# EAGLE design control-board-v2 (EAGLE 6.4)
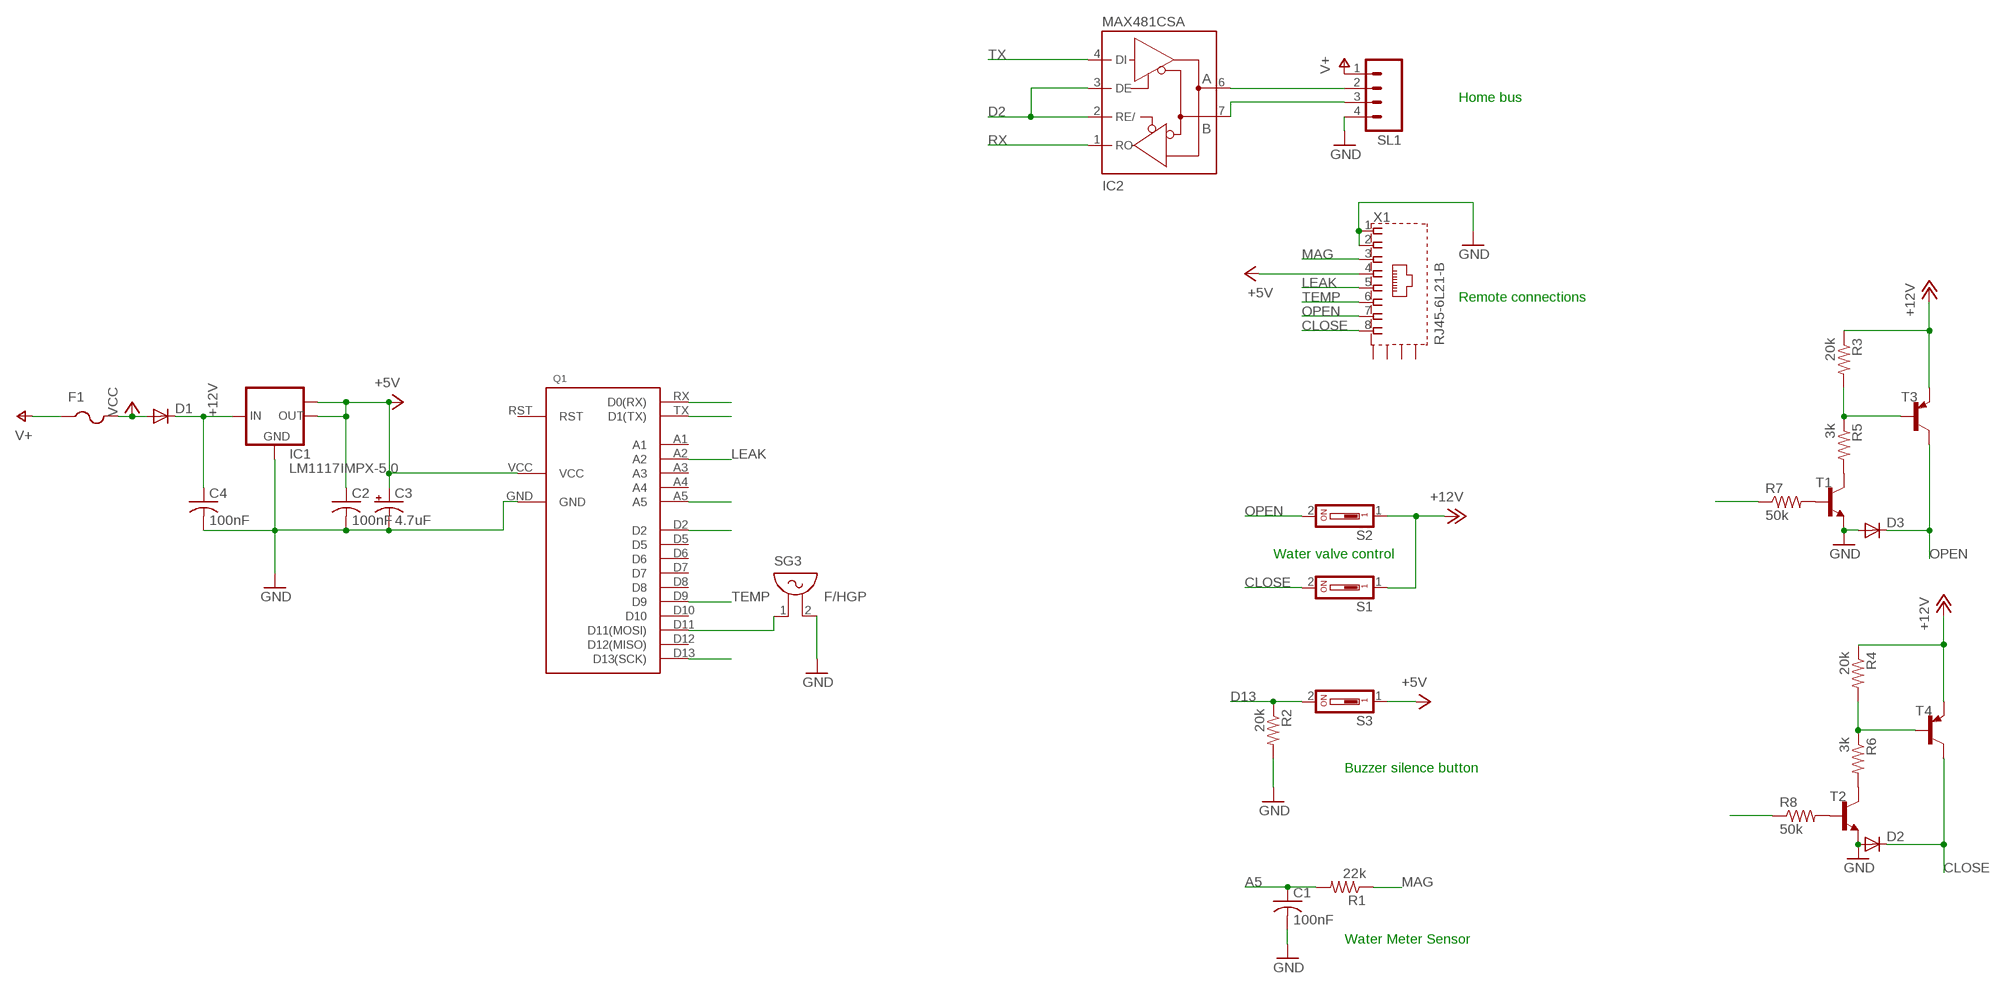
[diagram p0: schematic, sheet 1]

## Parts
C1  100nF  C-USC0603K  [C0603K]
C2  100nF  C-USC0603K  [C0603K]
C3  4.7uF  CPOL-USE1.8-4  [E1,8-4]
C4  100nF  C-USC0603K  [C0603K]
D1  DIODE-MICROMELF-W  [MICROMELF-W]
D2  DIODE-MICROMELF-W  [MICROMELF-W]
D3  DIODE-MICROMELF-W  [MICROMELF-W]
F1  PTCFUSE-1812  [1812]
IC1  LM1117IMPX-5.0  [SOT223]
IC2  MAX481CSA  [SO08]
Q1  HOME-CPU-V1  [HOME-CPU-V1]
R1  22k  R-US_R0603  [R0603]
R2  20k  R-US_R0603  [R0603]
R3  20k  R-US_R0603  [R0603]
R4  20k  R-US_R0603  [R0603]
R5  3k  R-US_R0603  [R0603]
R6  3k  R-US_R0603  [R0603]
R7  50k  R-US_R0603  [R0603]
R8  50k  R-US_R0603  [R0603]
S1  DS01  [DS-01]
S2  DS01  [DS-01]
S3  DS01  [DS-01]
SG3  F/HGP  [F/HGP]
SL1  M04  [04P]
T1  BC808-NPN-SOT23-BEC  [SOT23-BEC]
T2  BC808-NPN-SOT23-BEC  [SOT23-BEC]
T3  BC807-16-PNP-SOT23-BEC  [SOT23-BEC]
T4  BC807-16-PNP-SOT23-BEC  [SOT23-BEC]
X1  RJ45-6L21-B  [RJ45-SHIELD1]

## Nets
+12V: C4.1 D1.C IC1.3(IN) R3.1 R4.1 S1.1 S2.1 T3.E T4.E
A5: C1.1 Q1.A5 R1.2
CLOSE: D2.C S1.2 T4.C X1.8
D2: IC2.2(RE/) IC2.3(DE) Q1.D2
D13: Q1.D13(D13(SCK)) R2.1 S3.2
GND: C1.2 C2.2 C3.- C4.2 D2.A D3.A IC1.1(GND) Q1.GND R2.2 SG3.2 SL1.4 T1.E T2.E X1.1 X1.2
LEAK: Q1.A2 X1.5
MAG: R1.1 X1.3
N$1: D1.A F1.2 ; supply symbol labelled VCC
N$2: Q1.D11(D11(MOSI)) SG3.1
N$3: IC2.6(A) SL1.2
N$4: IC2.7(B) SL1.3
N$6: R4.2 R6.1 T4.B
N$8: R3.2 R5.1 T3.B
N$10: R7.2 T1.B
N$11: R8.2 T2.B
N$12: R5.2 T1.C
N$13: R6.2 T2.C
N$16: R7.1
N$17: R8.1
OPEN: D3.C S2.2 T3.C X1.7
RX: IC2.1(RO) Q1.RX(D0(RX))
TEMP: Q1.D9 X1.6
TX: IC2.4(DI) Q1.TX(D1(TX))
V+: F1.1 SL1.1
VCC: C2.1 C3.+ IC1.2(OUT) IC1.TAB(OUT1) Q1.VCC S3.1 X1.4 ; supply symbol labelled +5V
Unconnected: Q1.A1 Q1.A3 Q1.A4 Q1.D5 Q1.D6 Q1.D7 Q1.D8 Q1.D10 Q1.D12(D12(MISO)) Q1.RST X1.S1(S) X1.S2(S) X1.S3(S) X1.S4(S)

## Notes on the sheet
- Home bus
- Remote connections
- Water valve control
- Buzzer silence button
- Water Meter Sensor

## Power pins joined to a net without a drawn wire
GND: IC2.5(GND)
VCC: IC2.8(VCC)

## Library data of the parts
C1 C2 C4 = adafruit:C-US: CAPACITOR, American symbol
C3 = adafruit:CPOL-US: POLARIZED CAPACITOR, American symbol
D1-D3 = diode:DIODE-: DIODE
F1 = adafruit:PTCFUSE: PTC fuses, resettable thermistors
IC1 = lm1117:LM1117IMPX-*
IC2 = maxim:MAX481CSA: RS485 TRANSEIVER; MF: MAXIM; MPN: MAX481CSA; OC_FARNELL: unknown; OC_NEWARK: 90C3817
Q1 = serge:HOME-CPU-V1
R1-R8 = adafruit:R-US_: RESISTOR, American symbol
S1-S3 = switch-dil:DS01: DIL/CODE SWITCH; OC_FARNELL: unknown; OC_NEWARK: unknown
SG3 = buzzer:F/HGP: BUZZER Source: Buerklin; OC_FARNELL: unknown; OC_NEWARK: unknown
SL1 = con-amp-quick:M04: AMP QUICK CONNECTOR; OC_FARNELL: unknown; OC_NEWARK: unknown
T1 T2 = transistor:*-NPN-: NPN Transistror BF959 corrected 2008.03.06
T3 T4 = transistor:*-PNP-: PNP Transistror
X1 = con-tycoelectronics:RJ45*2: RJ45 Low Profile Shield Type 2 For all RJ45 L, LC, LCT and X Series Models Source: www.tycoelectronics.com .. ENG_DS_1654001_1099_RJ_L_0507.pdf; OC_FARNELL: unknown; OC_NEWARK: unknown

## Board
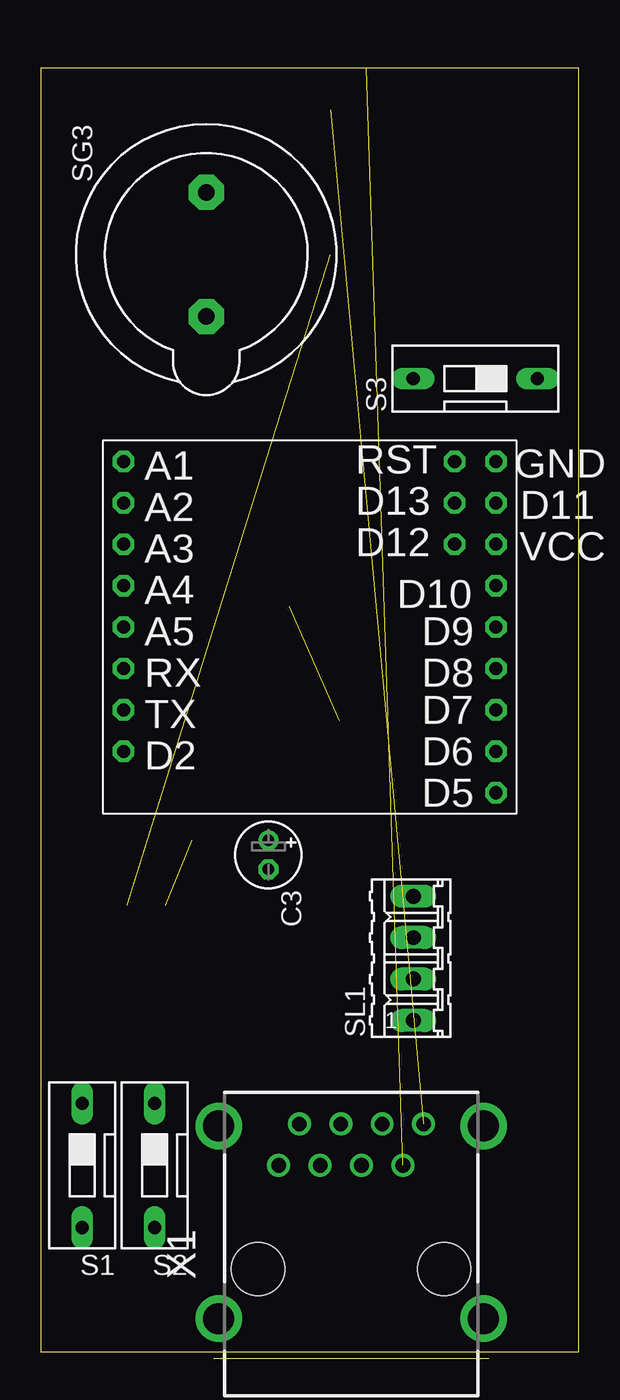
[diagram p1: board, top side]
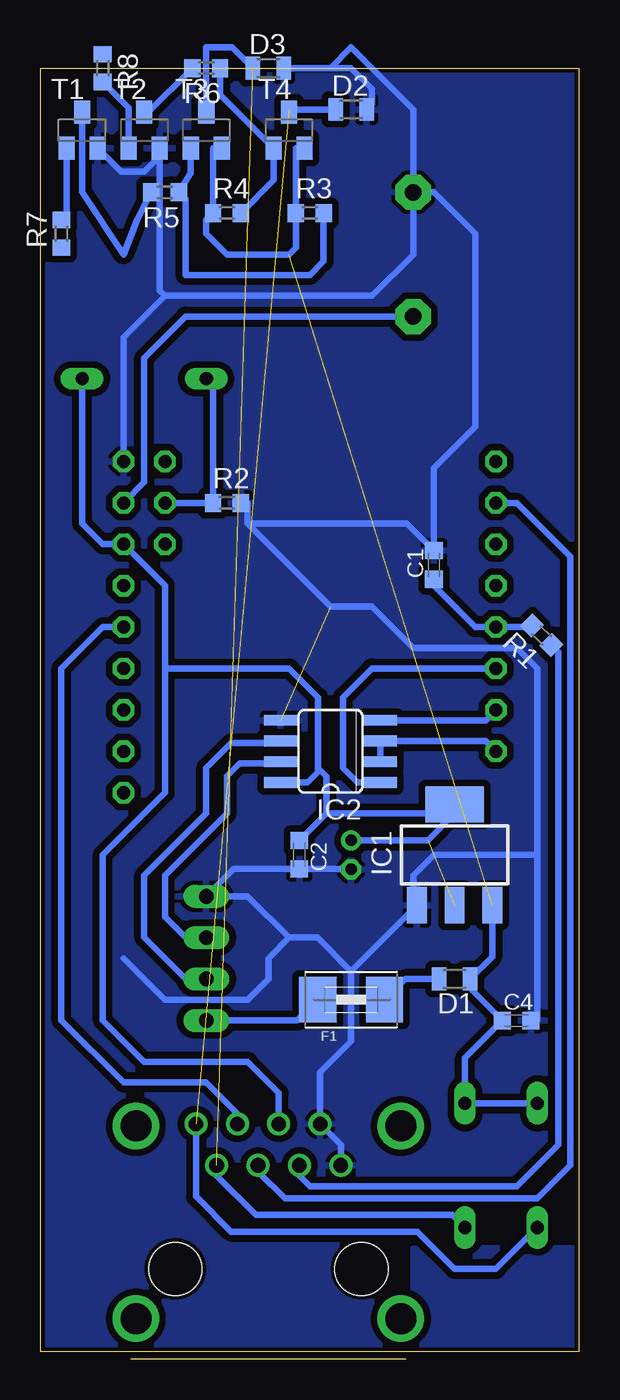
[diagram p2: board, bottom side, seen from below]

Size 33.02 x 78.74 mm. Coordinates in mm from the lower left corner, seen from the top.
Outline: 0,0 33.02,0 33.02,78.74 0,78.74 0,0
Copper layers (1*16): Top 0.035mm / dielectric 1.5mm / Bottom 0.035mm
Design rules "default *": minimum track width 10mil, minimum drill 24mil, track to track 16mil, track to pad 16mil, pad to pad 16mil, via to via 16mil, smd to smd 16mil, copper to edge 10mil, drill to drill 8mil, minimum pad ring 10mil, minimum via ring 8mil, stop-mask expansion 4mil, vias tented up to drill 0mil, thermal gap 10mil

### Footprints (pad centres in the part's own frame; a part is rotated, then mirrored left to right if it is on the bottom)
C0603K = smd 1.05 x 1.08: 1 -0.875,0; 2 0.875,0
E1,8-4 = drill 0.711 pad 1.168: + -0.889,0 | drill 0.711 pad 1.168 octagon: - 0.889,0
MICROMELF-W = smd 0.9 x 1.4: A 0.95,0; C -0.95,0
1812 = smd 2.286 x 2.794: 1 -2.046,0; 2 2.046,0
SOT223 = smd 1.219 x 2.235: 1 -2.311,-3.099; 2 0,-3.099; 3 2.311,-3.099 | smd 3.6 x 2.2: TAB 0,3.099
SO08 = smd 0.66 x 2.032: 1 -1.905,-3.073; 2 -0.635,-3.073; 3 0.635,-3.073; 4 1.905,-3.073; 5 1.905,3.073; 6 0.635,3.073; 7 -0.635,3.073; 8 -1.905,3.073
HOME-CPU-V1 = drill 0.8 octagon: A1 5.08,22.86; A2 2.54,22.86; A3 0,22.86; A4 -2.54,22.86; A5 -5.08,22.86; D2 -12.7,22.86; D5 -15.24,0; D6 -12.7,0; D7 -10.16,0; D8 -7.62,0; D9 -5.08,0; D10 -2.54,0; D11 2.54,0; D12 0,2.54; D13 2.54,2.54; GND 5.08,0; RST 5.08,2.54; RX -7.62,22.86; TX -10.16,22.86; VCC 0,0
R0603 = smd 1 x 1.1: 1 -0.85,0; 2 0.85,0
DS-01 = drill 0.813 long: 1 0,-3.81; 2 0,3.81
F/HGP = drill 1.016 pad 2.159 octagon: 1 -3.81,0; 2 3.81,0
04P = drill 0.914 long: 1 -3.81,0; 2 -1.27,0; 3 1.27,0; 4 3.81,0
SOT23-BEC = smd 1 x 1.4: B -0.95,-1.1; C 0,1.1; E 0.95,-1.1
RJ45-SHIELD1 = drill 0.9 pad 1.4: 1 -4.445,6.35; 2 -3.175,8.89; 3 -1.905,6.35; 4 -0.635,8.89; 5 0.635,6.35; 6 1.905,8.89; 7 3.175,6.35; 8 4.445,8.89 | drill 1.9 pad 2.5: S1 -8.128,-3.048; S2 8.128,-3.048; S3 -8.128,8.76; S4 8.128,8.76 | hole 3.251: -5.715,0; 5.715,0

### Placement (x,y rotation side)
C1  8.89,48.26 90 bottom
C2  17.14,30.48 270 bottom
C3  13.97,30.48 270 top
C4  3.81,20.32 0 bottom
D1  7.62,22.86 180 bottom
D2  13.97,76.2 0 bottom
D3  19.05,78.74 0 bottom
F1  13.97,21.59 0 bottom
IC1  7.62,30.48 0 bottom
IC2  15.24,36.83 90 bottom
Q1  27.94,49.53 90 top
R1  2.29,43.94 135 bottom
R2  21.59,52.07 0 bottom
R3  16.51,69.85 0 bottom
R4  21.59,69.85 0 bottom
R5  25.4,71.12 180 bottom
R6  22.86,78.74 180 bottom
R7  31.75,68.58 90 bottom
R8  29.21,78.74 270 bottom
S1  2.54,11.43 180 top
S2  6.99,11.43 180 top
S3  26.67,59.69 90 top
SG3  10.16,67.31 90 top
SL1  22.86,24.13 90 top
T1  30.48,74.93 0 bottom
T2  26.67,74.93 0 bottom
T3  22.86,74.93 0 bottom
T4  17.78,74.93 0 bottom
X1  19.05,5.08 0 top

### Tracks (layer width: path | path; a pad name or v marks a point on that pad's centre or on a via)
+12V  (1 unrouted)
  Bottom 0.406: S1.1 S2.1 6.99,18.02 C4.1 6.67,22.3 D1.C 5.31,24.22 IC1.3 | T4.E 17.36,73.83 R3.1 17.36,67.73 17.78,67.31 21.59,67.31 22.86,68.58 22.86,69.43 R4.1 22.44,73.83 T3.E
A5
  Bottom 0.406: R1.2 2.54,44.45 Q1.A5 6.35,44.45 8.89,46.99 C1.1
CLOSE  (1 unrouted)
  Bottom 0.406: X1.8 23.5,9.53 21.34,7.37 9.91,7.37 7.62,5.08 5.08,5.08 S1.2 | D2.C 17.61,76.2 T4.C 17.78,76.2
D2
  Bottom 0.406: IC2.2 IC2.3 5.71,37.46 Q1.D2
D13
  Bottom 0.406: Q1.D13 R2.1 22.44,59.27 S3.2
GND  (1 unrouted)
  Bottom 0.406: Q1.GND 27.94,62.23 25.4,64.77 | R2.2 20.32,52.07 20.32,50.8 | C4.2 2.54,20.32 2.54,30.48 | X1.1 14.61,12.7 X1.2 15.88,17.14 13.97,19.05 13.97,23.34 | 13.97,23.34 IC1.1 10.16,27.61 10.16,29.21 8.89,30.48 2.54,30.48 | 17.78,25.4 20.32,27.94 SL1.4 21.2,29.61 C2.2 13.98,29.61 C3.- | 17.78,25.4 16.03,25.4 13.97,23.34 | 17.78,25.4 19.05,24.13 19.05,22.86 20.32,21.59 25.4,21.59 27.94,24.13 | 2.54,30.48 2.54,41.91 3.81,43.18 10.16,43.18 12.7,45.72 15.24,45.72 20.32,50.8 | 20.32,50.8 10.55,50.8 C1.2 8.89,54.21 6.35,56.75 6.35,68.58 8.89,71.12 SG3.2 | SG3.2 10.16,67.31 12.7,64.77 25.4,64.77 | D2.A 12.7,76.52 12.7,77.47 13.97,78.74 D3.A 15.24,78.74 13.97,80.01 10.16,76.2 SG3.2 | T1.E 28.09,72.39 26.67,72.39 25.72,73.34 T2.E 25.72,65.09 25.4,64.77
  pour Bottom: -1.27,78.74 33.02,78.74 33.02,0 7.62,0 7.62,3.81 0,3.81
LEAK
  Bottom 0.406: X1.5 19.68,11.05 18.03,9.4 2.54,9.4 0.51,11.43 0.51,48.77 3.81,52.07 Q1.A2
MAG
  Bottom 0.406: X1.3 17.14,10.79 16.51,10.16 3.81,10.16 1.27,12.7 1.27,42.93 R1.1
N$1
  Bottom 0.406: D1.A 10.65,22.86 F1.2
N$2
  Bottom 0.406: Q1.D11 26.67,53.34 26.67,60.96 24.13,63.5 SG3.1
N$3
  Bottom 0.406: SL1.2 24.13,22.86 26.67,25.4 26.67,29.21 22.86,33.02 22.86,35.81 21.34,37.34 18.44,37.34 IC2.6
N$4
  Bottom 0.406: SL1.3 24.13,25.4 25.4,26.67 25.4,29.21 21.59,33.02 21.59,35.31 20.83,36.07 18.44,36.07 IC2.7
N$5
  pour Bottom: 0,0 0,6.35 10.16,6.35 10.16,0
N$6
  Bottom 0.406: R4.2 18.73,71.86 T4.B 22.01,77.11 R6.1
N$8
  Bottom 0.406: T3.B 23.81,72.29 R5.1 24.13,70.7 24.13,66.04 16.51,66.04 15.66,66.89 R3.2
N$10
  Bottom 0.406: T1.B 31.43,69.75 R7.2
N$11
  Bottom 0.406: T2.B 27.62,76.3 R8.2
N$12
  Bottom 0.406: R5.2 27.09,69.43 27.94,67.31 30.48,71.12 T1.C
N$13
  Bottom 0.406: T2.C 26.42,76.03 R6.2
OPEN  (1 unrouted)
  Bottom 0.406: X1.7 22.23,10.79 19.81,8.38 7.75,8.38 S2.2 | T3.C 22.86,80.01 21.27,80.01 D3.C
RX
  Bottom 0.406: IC2.1 13.59,34.92 14.48,35.81 14.48,40.13 12.7,41.91 Q1.RX
TEMP
  Bottom 0.406: X1.6 20.95,14.61 22.86,16.51 27.94,16.51 31.75,20.32 31.75,41.91 29.21,44.45 Q1.D9
TX
  Bottom 0.406: IC2.4 5.71,38.73 Q1.TX
V+
  Bottom 0.406: SL1.1 17.29,20.32 F1.1
VCC  (1 unrouted)
  Bottom 0.406: 15.48,33.02 7.62,33.02 | 7.62,33.02 IC1.TAB | C3.+ 9.27,31.37 7.62,33.02 | 15.48,33.02 C2.1 | IC2.8 16.64,34.92 16,35.56 16,35.81 | 16,35.81 16,40.13 17.78,41.91 25.4,41.91 | 15.48,33.02 15.48,35.29 16,35.81 | X1.4 18.41,15.88 20.32,17.78 26.67,17.78 29.21,20.32 29.21,30.48 25.4,34.29 25.4,41.91 | 25.4,41.91 25.4,46.99 Q1.VCC 29.21,49.53 30.48,50.8 S3.1